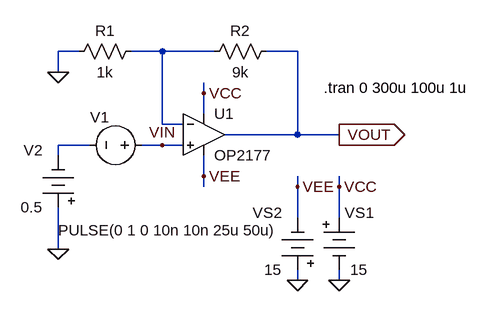
[diagram p0: schematic fig-02-02-11.asc]
fig-02-02-11.asc, the LTspice schematic file:
Version 4
SHEET 1 880 680
WIRE -32 64 -64 64
WIRE 96 64 48 64
WIRE 176 64 96 64
WIRE 304 64 256 64
WIRE -64 96 -64 64
WIRE 160 128 160 112
WIRE 160 160 160 128
WIRE 96 176 96 64
WIRE 128 176 96 176
WIRE 304 192 304 64
WIRE 304 192 192 192
WIRE 368 192 304 192
WIRE -16 208 -64 208
WIRE 96 208 64 208
WIRE 128 208 96 208
WIRE -64 224 -64 208
WIRE 160 256 160 224
WIRE 160 272 160 256
WIRE 304 272 304 256
WIRE 368 272 368 256
WIRE 304 320 304 272
WIRE 368 320 368 272
WIRE -64 368 -64 304
WIRE 304 416 304 400
WIRE 368 416 368 400
FLAG -64 368 0
FLAG 368 192 VOUT
IOPIN 368 192 Out
FLAG 304 416 0
FLAG 368 416 0
FLAG 304 272 VEE
FLAG 368 272 VCC
FLAG 160 128 VCC
FLAG 160 256 VEE
FLAG -64 96 0
FLAG 96 208 VIN
SYMBOL voltage 80 208 R90
WINDOW 3 131 -193 VRight 2
WINDOW 123 41 56 Left 2
WINDOW 39 0 0 Left 2
WINDOW 0 -43 95 VLeft 2
SYMATTR Value PULSE(0 1 0 10n 10n 25u 50u)
SYMATTR InstName V1
SYMBOL OP2177 160 128 R0
SYMATTR InstName U1
SYMBOL res 272 48 R90
WINDOW 0 0 56 VBottom 2
WINDOW 3 32 56 VTop 2
SYMATTR InstName R2
SYMATTR Value 9k
SYMBOL res 64 48 R90
WINDOW 0 0 56 VBottom 2
WINDOW 3 32 56 VTop 2
SYMATTR InstName R1
SYMATTR Value 1k
SYMBOL Misc\\battery 368 304 R0
WINDOW 0 9 8 Left 2
WINDOW 3 17 96 Left 2
WINDOW 123 0 0 Left 0
WINDOW 39 0 0 Left 0
SYMATTR InstName VS1
SYMATTR Value 15
SYMBOL Misc\\battery 304 416 R180
WINDOW 0 24 104 Left 2
WINDOW 3 24 16 Left 2
WINDOW 123 0 0 Left 0
WINDOW 39 0 0 Left 0
SYMATTR InstName VS2
SYMATTR Value 15
SYMBOL Misc\\battery -64 320 R180
WINDOW 0 24 104 Left 2
WINDOW 3 24 16 Left 2
SYMATTR InstName V2
SYMATTR Value 0.5
TEXT 344 120 Left 2 !.tran 0 300u 100u 1u

The netlist it stands for:
* fig-02-02-11.asc
V1 VIN N002 PULSE(0 1 0 10n 10n 25u 50u)
* U1: OP2177 (symbol OP2177 not available, pins judged from their places): In+=VIN In-=N001 V+=VCC V-=VEE OUT=VOUT
R2 VOUT N001 9k
R1 N001 0 1k
VS1 VCC 0 15
VS2 0 VEE 15
V2 0 N002 0.5
.tran 0 300u 100u 1u
.backanno
.end